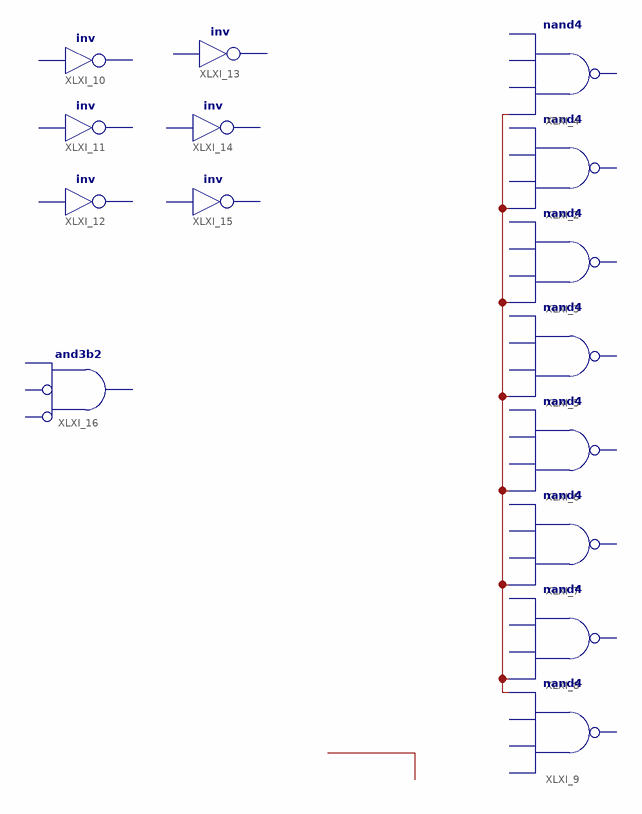
[diagram p0: schematic sheet 1]
// Xilinx ISE schematic Papilio_One_250K.sch (spartan3e) as structural Verilog: 15 symbols, 0 ports
module Papilio_One_250K (
);

  wire XLXN_1;

  // nand4 XLXI_2 has open pins: I0=XLXN_1, I1=open, I2=open, I3=open, O=open
  // nand4 XLXI_3 has open pins: I0=XLXN_1, I1=open, I2=open, I3=open, O=open
  // nand4 XLXI_4 has open pins: I0=XLXN_1, I1=open, I2=open, I3=open, O=open
  // nand4 XLXI_5 has open pins: I0=XLXN_1, I1=open, I2=open, I3=open, O=open
  // nand4 XLXI_6 has open pins: I0=XLXN_1, I1=open, I2=open, I3=open, O=open
  // nand4 XLXI_7 has open pins: I0=XLXN_1, I1=open, I2=open, I3=open, O=open
  // nand4 XLXI_8 has open pins: I0=XLXN_1, I1=open, I2=open, I3=open, O=open
  // nand4 XLXI_9 has open pins: I0=open, I1=open, I2=open, I3=XLXN_1, O=open
  // inv XLXI_10 is placed but not wired
  // inv XLXI_11 is placed but not wired
  // inv XLXI_12 is placed but not wired
  // inv XLXI_13 is placed but not wired
  // inv XLXI_14 is placed but not wired
  // inv XLXI_15 is placed but not wired
  // and3b2 XLXI_16 is placed but not wired
endmodule
